# EAGLE design MIDIPak_v1 (EAGLE 7.7.0)
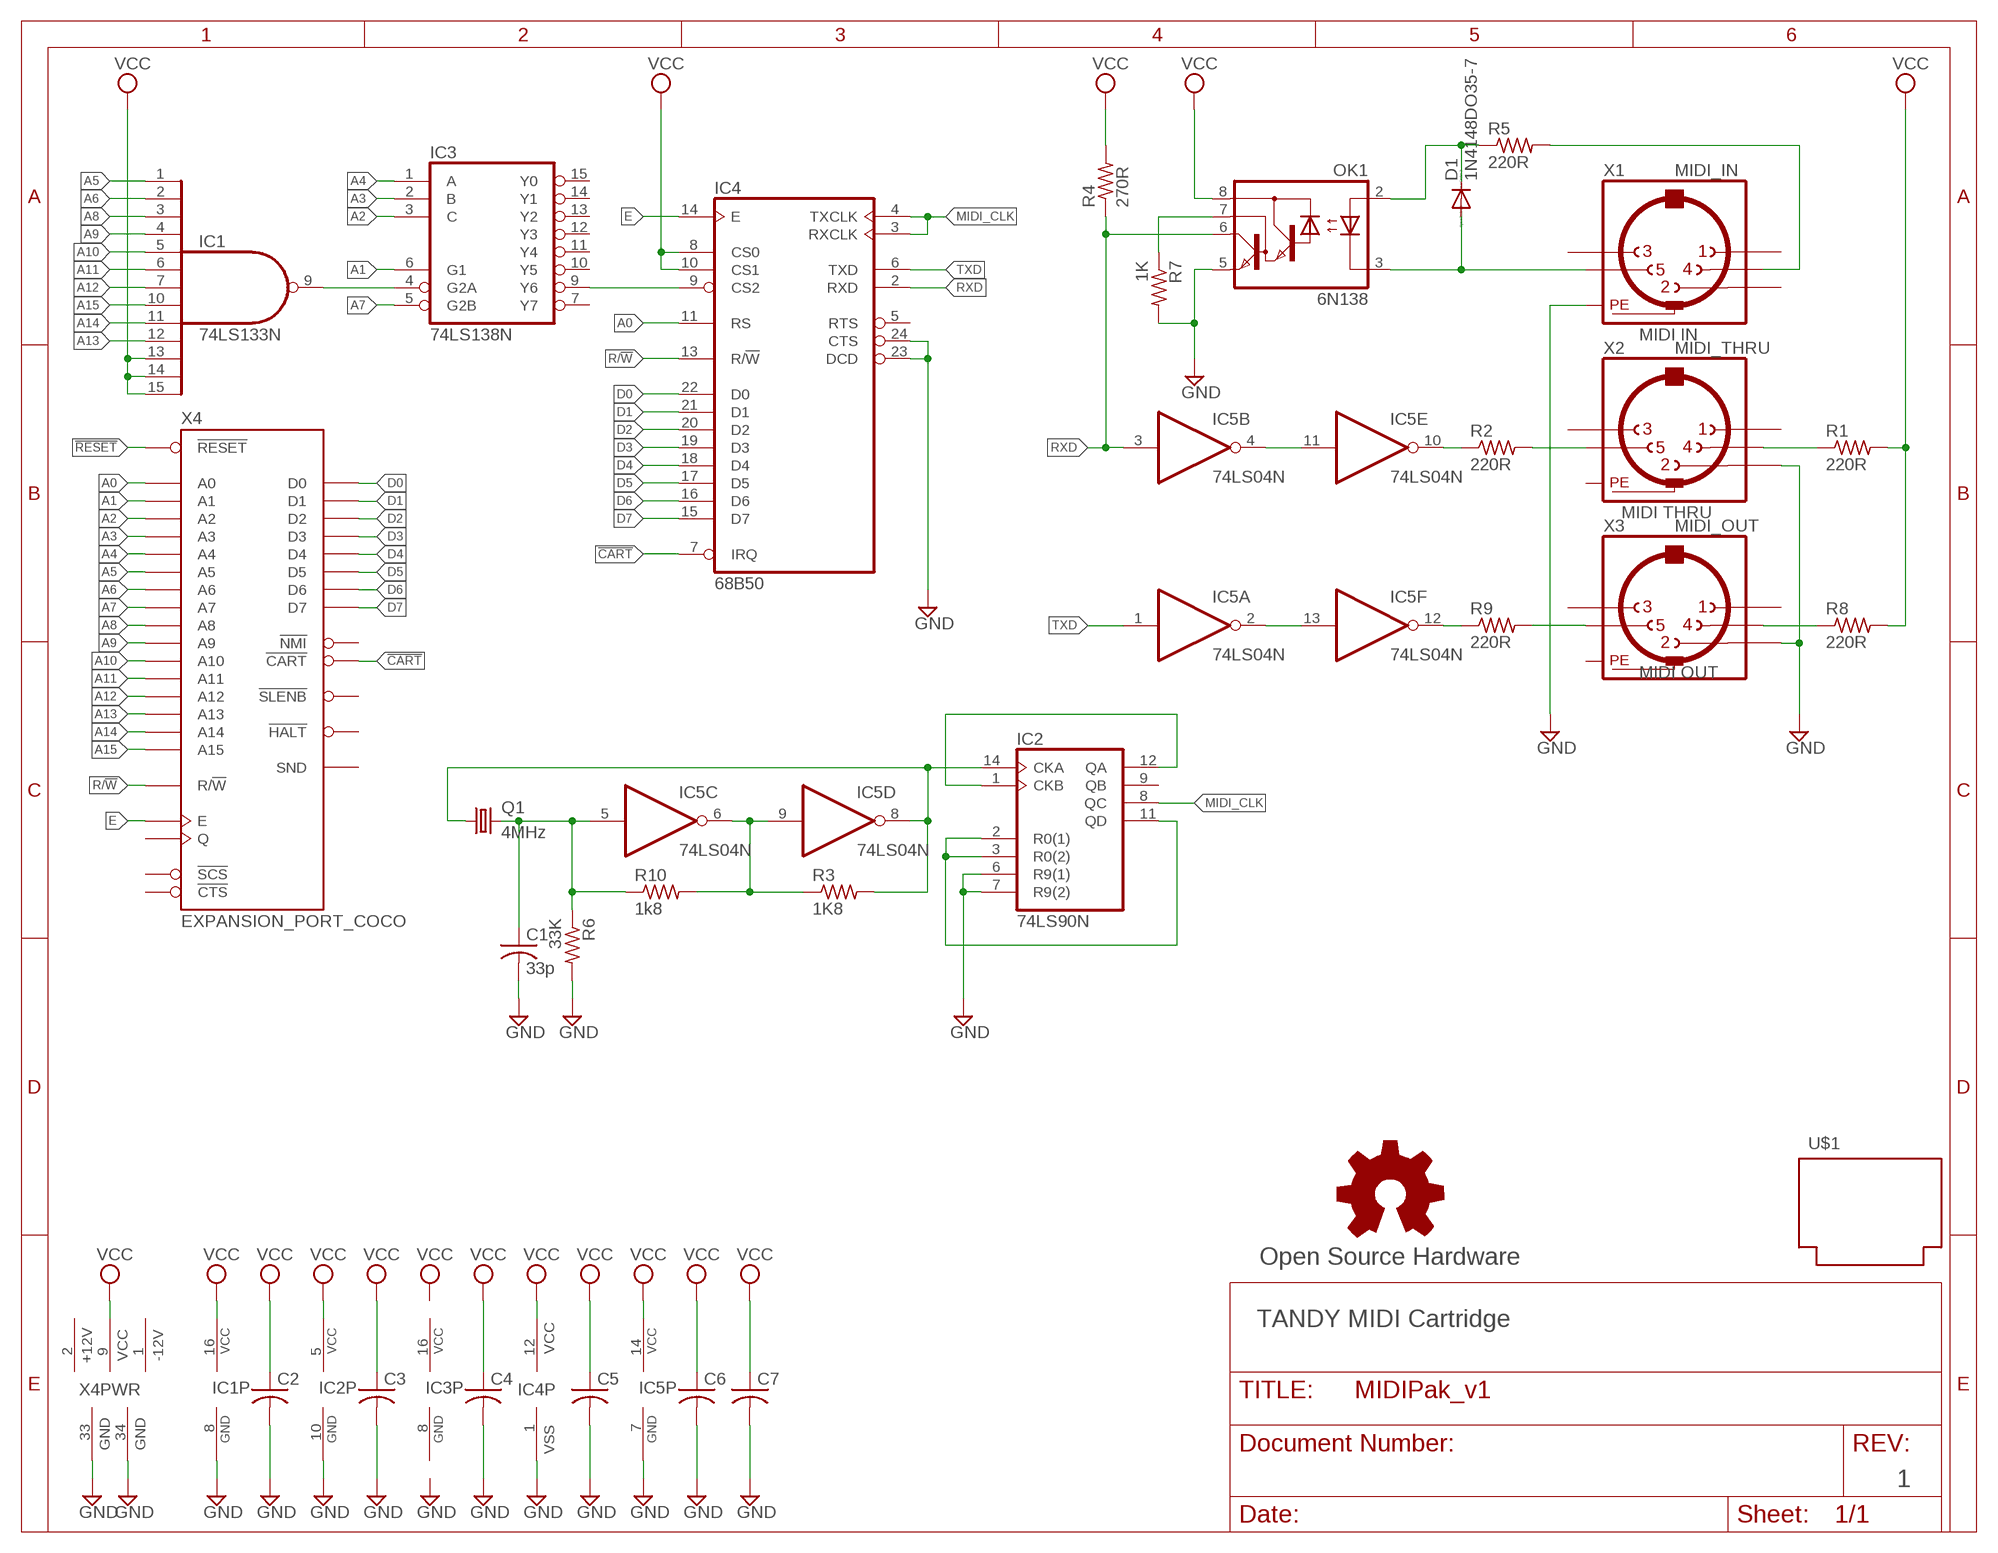
[diagram p0: schematic, sheet 1]

## Parts
C1  33p  C-US025-025X050  [C025-025X050]
C2  C-US025-025X050  [C025-025X050]
C3  C-US025-025X050  [C025-025X050]
C4  C-US025-025X050  [C025-025X050]
C5  C-US025-025X050  [C025-025X050]
C6  C-US025-025X050  [C025-025X050]
C7  C-US025-025X050  [C025-025X050]
D1  1N4148DO35-7  [DO35-7]
GOLD_ORB_SM1  Open Source Hardware  OSHWLOGOLOGO8MM  [OSHW_8MM]
IC1  74LS133N  74S133N  [DIL16-RP]
IC2  74LS90N  [DIL14-RP]
IC3  74LS138N  [DIL16-RP]
IC4  68B50  6850-RP  [DIL24-ROUNDPAD]
IC5  74LS04N  [DIL14-RP]
OK1  6N138  [DIL08]
Q1  4MHz  CRYSTALHC49U-V  [HC49U-V]
R1  220R  R-US_0204/7  [0204/7]
R2  220R  R-US_0204/7  [0204/7]
R3  1K8  R-US_0204/7  [0204/7]
R4  270R  R-US_0204/7  [0204/7]
R5  220R  R-US_0204/7  [0204/7]
R6  33K  R-US_0204/7  [0204/7]
R7  1K  R-US_0204/7  [0204/7]
R8  220R  R-US_0204/7  [0204/7]
R9  220R  R-US_0204/7  [0204/7]
R10  1k8  R-US_0204/7  [0204/7]
U$1  PROGRAM_PAK  [PROGRAM_PAK]
X1  MIDI_IN  MAB5SH  [MAB5SH]
X2  MIDI_THRU  MAB5SH  [MAB5SH]
X3  MIDI_OUT  MAB5SH  [MAB5SH]
X4  EXPANSION_PORT_COCO  [MA20-2]

## Nets
!CART: IC4.7(IRQ) X4.8(!CART)
!RESET: X4.5(!RESET)
A0: IC4.11(RS) X4.19(A0)
A1: IC3.6(G1) X4.20(A1)
A2: IC3.3(C) X4.21(A2)
A3: IC3.2(B) X4.22(A3)
A4: IC3.1(A) X4.23(A4)
A5: IC1.1(I0) X4.24(A5)
A6: IC1.2(I1) X4.25(A6)
A7: IC3.5(G2B) X4.26(A7)
A8: IC1.3(I2) X4.27(A8)
A9: IC1.4(I3) X4.28(A9)
A10: IC1.5(I4) X4.29(A10)
A11: IC1.6(I5) X4.30(A11)
A12: IC1.7(I6) X4.31(A12)
A13: IC1.12(I9) X4.37(A13)
A14: IC1.11(I8) X4.38(A14)
A15: IC1.10(I7) X4.39(A15)
D0: IC4.22(D0) X4.10(D0)
D1: IC4.21(D1) X4.11(D1)
D2: IC4.20(D2) X4.12(D2)
D3: IC4.19(D3) X4.13(D3)
D4: IC4.18(D4) X4.14(D4)
D5: IC4.17(D5) X4.15(D5)
D6: IC4.16(D6) X4.16(D6)
D7: IC4.15(D7) X4.17(D7)
E: IC4.14(E) X4.6(E)
GND: C1.2 C2.2 C3.2 C4.2 C5.2 C6.2 C7.2 IC1.8(GND) IC2.6(R9(1)) IC2.7(R9(2)) IC2.10(GND) IC4.1(VSS) IC4.23(DCD) IC4.24(CTS) IC5.7(P:GND) OK1.5(GND) R6.2 R7.2 X1.PE X1.PE@(PE) X2.2 X3.2 X4.33(GND) X4.34(GND)
MIDI_CLK: IC2.8(QC) IC4.3(RXCLK) IC4.4(TXCLK)
N$1: R9.2 X3.5
N$2: IC5.2(A:O) IC5.13(F:I)
N$3: R8.1 X3.4
N$4: IC5.12(F:O) R9.1
N$5: IC3.9(Y6) IC4.9(CS2)
N$6: D1.C OK1.2(A) R5.1
N$7: R5.2 X1.4
N$8: D1.A OK1.3(C) X1.5
N$9: OK1.7(VB) R7.1
N$10: R2.2 X2.5
N$11: IC5.10(E:O) R2.1
N$12: IC5.4(B:O) IC5.11(E:I)
N$13: R1.1 X2.4
N$14: IC1.9(O) IC3.4(G2A)
N$15: C1.1 IC5.5(C:I) Q1.2 R6.1 R10.1
N$16: IC5.6(C:O) IC5.9(D:I) R3.1 R10.2
N$17: IC2.14(CKA) IC5.8(D:O) Q1.1 R3.2
N$19: IC2.1(CKB) IC2.12(QA)
N$20: IC2.2(R0(1)) IC2.3(R0(2)) IC2.11(QD)
R/!W: IC4.13(R/!W) X4.18(R/!W)
RXD: IC4.2(RXD) IC5.3(B:I) OK1.6(VO) R4.1
TXD: IC4.6(TXD) IC5.1(A:I)
VCC: C2.1 C3.1 C4.1 C5.1 C6.1 C7.1 IC1.13(I10) IC1.14(I11) IC1.15(I12) IC1.16(VCC) IC2.5(VCC) IC4.8(CS0) IC4.10(CS1) IC4.12(VCC) IC5.14(P:VCC) OK1.8(VCC) R1.2 R4.2 R8.2 X4.9(VCC)
Unconnected: IC2.9(QB) IC3.7(Y7) IC3.10(Y5) IC3.11(Y4) IC3.12(Y3) IC3.13(Y2) IC3.14(Y1) IC3.15(Y0) IC4.5(RTS) X1.1 X1.2 X1.3 X2.1 X2.3 X3.1 X3.3 X4.3(!HALT) X4.4(!NMI) X4.7(Q) X4.32(!CTS) X4.35(SND) X4.36(!SCS) X4.40(!SLENB)

## Notes on the sheet
- MIDI IN
- MIDI THRU
- MIDI OUT
- TANDY MIDI Cartridge
- 1

## Power pins joined to a net without a drawn wire
+12V: X4.2(+12V)
-12V: X4.1(-12V)
GND: IC3.8(GND)
PE: X2.PE X2.PE@(PE) X3.PE X3.PE@(PE)
VCC: IC3.16(VCC)

## Library data of the parts
C1-C7 = rcl:C-US: CAPACITOR, American symbol
D1 = diode-jlb:1N4148: DIODE high speed (Philips)
GOLD_ORB_SM1 = oshw:OSHWLOGO: The OSHW logo for PCB layout
IC1 = 74xx-us-jlb:74*133: 13-input NAND gate
IC2 = 74xx-us-jlb:74*90: Decade, divide by twelve and binary COUNTER
IC3 = 74xx-us-jlb:74*138: 3-line to 8-line DECODER/DEMULTIPLEXER
IC4 = micro-motorola:6850: MICROCONTROLLER/MEMORY DEVICE
IC5 = 74xx-us-jlb:74*04: Hex INVERTER
OK1 = optocoupler-jlb:6N138: MOTOROLA OPTO COUPLER; MF: VISHAY/TELEFUNKEN; MPN: 6N138; OC_FARNELL: 9860150; OC_NEWARK: 35K5294
Q1 = crystal:CRYSTAL: CRYSTAL; OC_FARNELL: 1666969; OC_NEWARK: unknown
R1-R10 = resistor:R-US_: RESISTOR, American symbol
U$1 = coco:PROGRAM_PAK
X1-X3 = con-hirschmann:MAB5SH: Female CONNECTOR 5 pins 90 deg. with shield, horizontal (DIN 41524); OC_FARNELL: 809883; OC_NEWARK: unknown
X4 = coco:EXPANSION_PORT_COCO

## Board
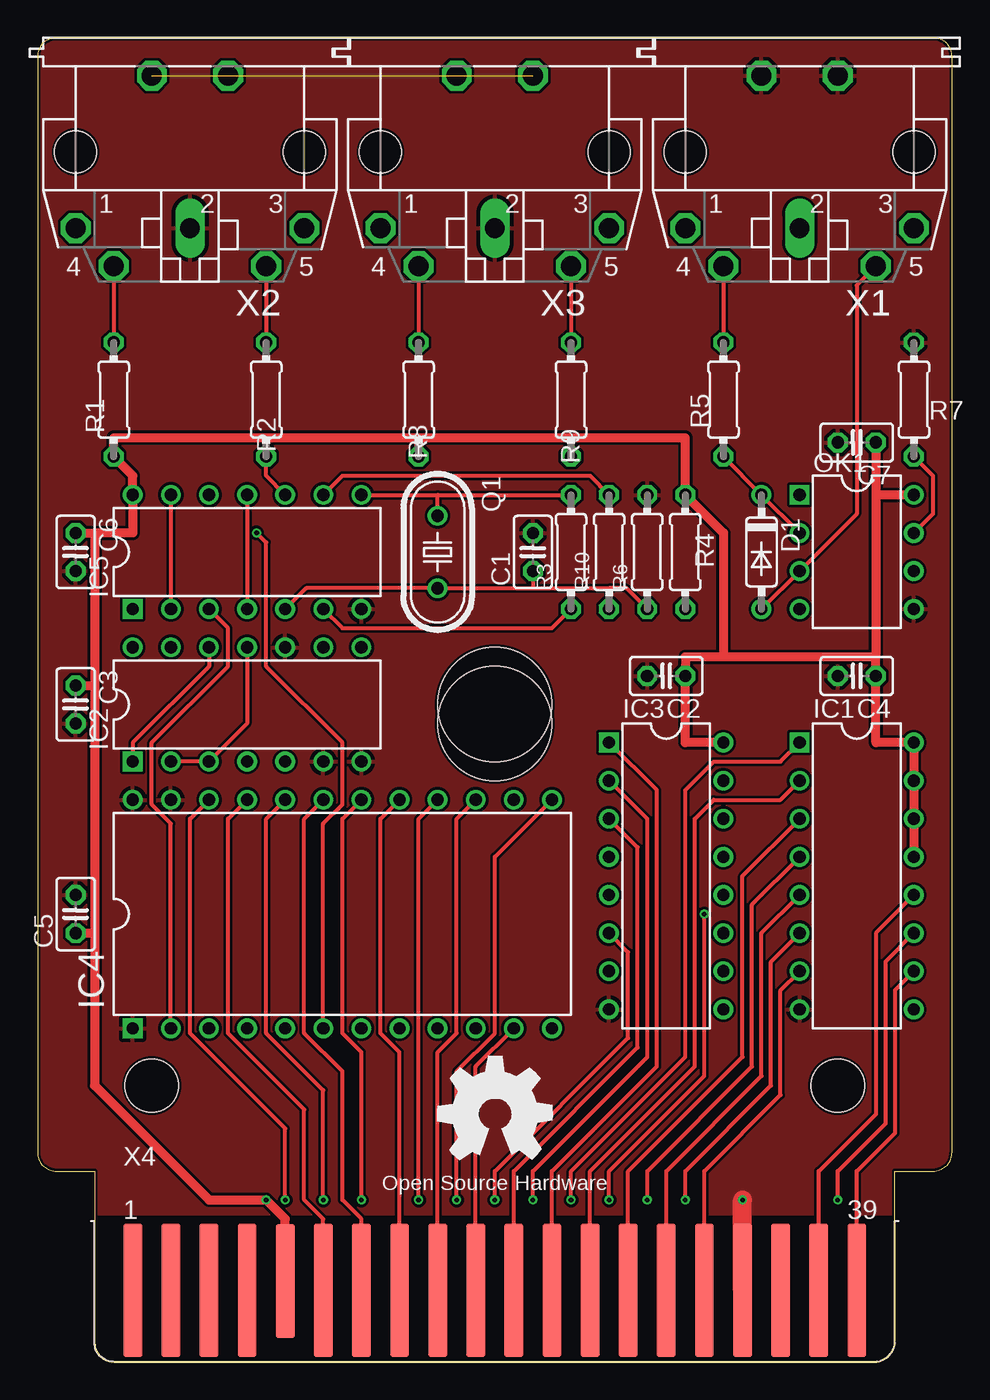
[diagram p1: board, top side]
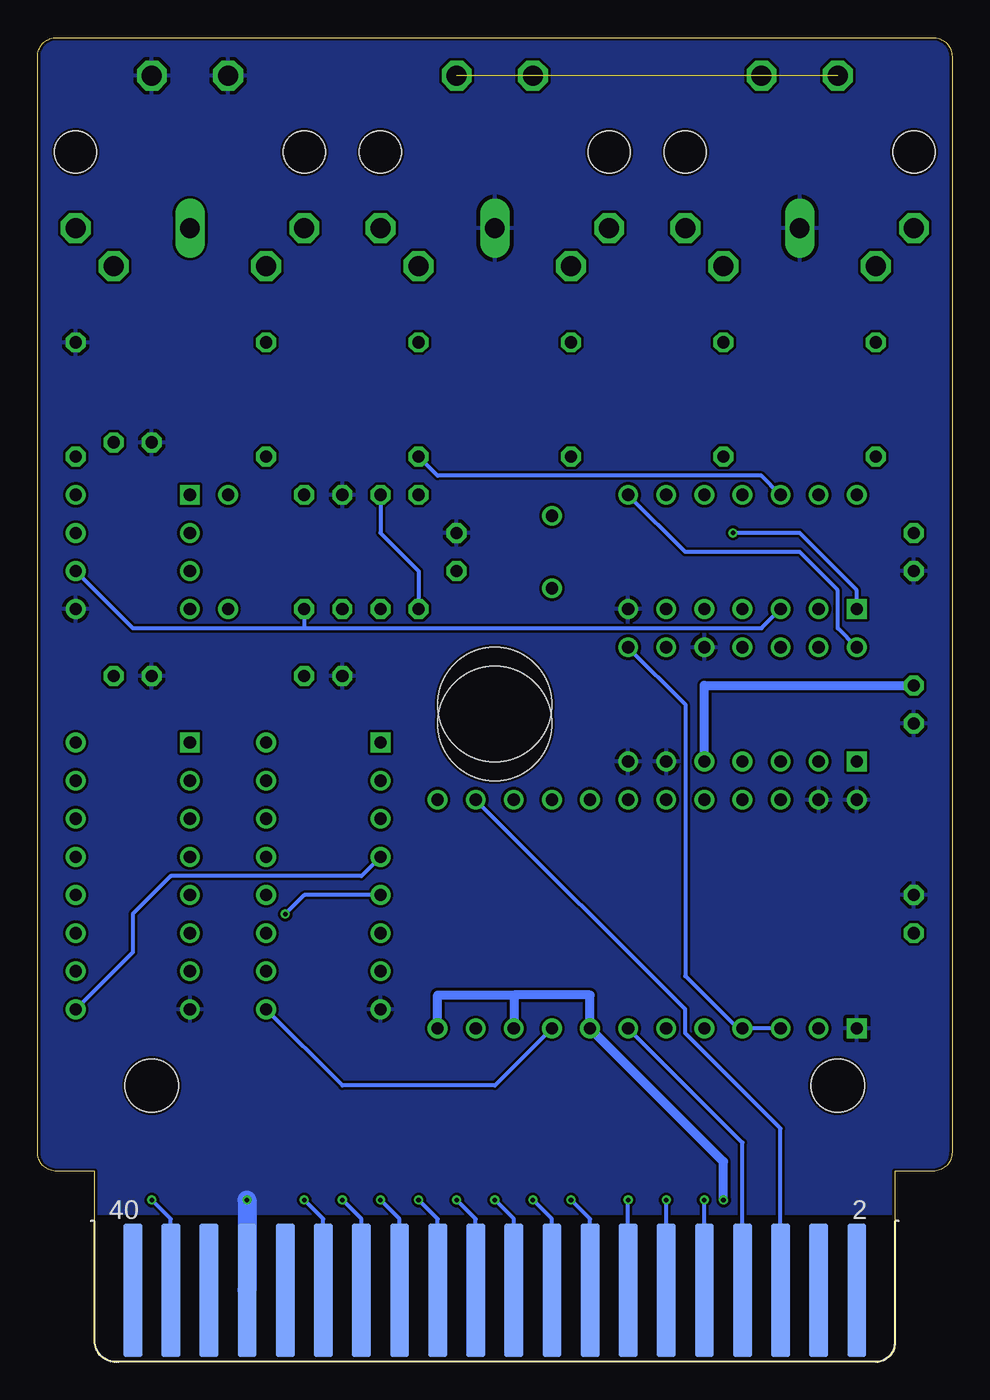
[diagram p2: board, bottom side, seen from below]

Size 60.96 x 88.27 mm. Coordinates in mm from the lower left corner, seen from the top.
Outline: 3.81,12.71 3.81,1.28 arc90 5.08,0.01 55.56,0.01 arc90 57.15,1.28 57.15,12.71 59.69,12.71 arc90 60.96,13.98 60.96,87 arc90 59.69,88.27 1.27,88.27 arc90 0,87 0,13.98 arc90 1.27,12.71 3.81,12.71
Copper layers (1*16): Top 0.035mm / dielectric 1.5mm / Bottom 0.035mm
Design rules "hackvana *": minimum track width 6mil, minimum drill 0.3mm, track to track 6mil, track to pad 6mil, pad to pad 6mil, via to via 6mil, smd to smd 0mil, copper to edge 6mil, drill to drill 6mil, minimum pad ring 10mil, minimum via ring 6mil, stop-mask expansion 2mil, vias tented up to drill 100mil, thermal gap 10mil

### Footprints (pad centres in the part's own frame; a part is rotated, then mirrored left to right if it is on the bottom)
C025-025X050 = drill 0.813 octagon: 1 -1.27,0; 2 1.27,0
DO35-7 = drill 0.813: A 3.81,0; C -3.81,0
DIL16-RP = drill 0.813 square: 1 -8.89,-3.81 | drill 0.813: 2 -6.35,-3.81; 3 -3.81,-3.81; 4 -1.27,-3.81; 5 1.27,-3.81; 6 3.81,-3.81; 7 6.35,-3.81; 8 8.89,-3.81; 9 8.89,3.81; 10 6.35,3.81; 11 3.81,3.81; 12 1.27,3.81; 13 -1.27,3.81; 14 -3.81,3.81; 15 -6.35,3.81; 16 -8.89,3.81
DIL14-RP = drill 0.813 square: 1 -7.62,-3.81 | drill 0.813: 2 -5.08,-3.81; 3 -2.54,-3.81; 4 0,-3.81; 5 2.54,-3.81; 6 5.08,-3.81; 7 7.62,-3.81; 8 7.62,3.81; 9 5.08,3.81; 10 2.54,3.81; 11 0,3.81; 12 -2.54,3.81; 13 -5.08,3.81; 14 -7.62,3.81
DIL24-ROUNDPAD = drill 0.813 square: 1 -13.97,-7.62 | drill 0.813: 2 -11.43,-7.62; 3 -8.89,-7.62; 4 -6.35,-7.62; 5 -3.81,-7.62; 6 -1.27,-7.62; 7 1.27,-7.62; 8 3.81,-7.62; 9 6.35,-7.62; 10 8.89,-7.62; 11 11.43,-7.62; 12 13.97,-7.62; 13 13.97,7.62; 14 11.43,7.62; 15 8.89,7.62; 16 6.35,7.62; 17 3.81,7.62; 18 1.27,7.62; 19 -1.27,7.62; 20 -3.81,7.62; 21 -6.35,7.62; 22 -8.89,7.62; 23 -11.43,7.62; 24 -13.97,7.62
DIL08 = drill 0.813 square: 1 -3.81,-3.81 | drill 0.813: 2 -1.27,-3.81; 3 1.27,-3.81; 4 3.81,-3.81; 5 3.81,3.81; 6 1.27,3.81; 7 -1.27,3.81; 8 -3.81,3.81
HC49U-V = drill 0.813: 1 -2.413,0; 2 2.413,0
0204/7 = drill 0.813 octagon: 1 -3.81,0; 2 3.81,0
PROGRAM_PAK = hole 7.62: 0,1.27; 0,0 | hole 3.556: -22.86,-24.13; 22.86,-24.13
MAB5SH = drill 1.321 octagon: 1 7.62,5.08; 3 -7.62,5.08; 4 5.08,7.62; 5 -5.08,7.62; PE -2.54,-5.08; PE@ 2.54,-5.08 | drill 1.321 long: 2 0,5.08 | hole 2.794: 7.62,0; -7.62,0
MA20-2 = smd 1.27 x 8.89: 1 -24.13,-0.305; 3 -21.59,-0.305; 5 -19.05,-0.305; 7 -16.51,-0.305; 11 -11.43,-0.305; 13 -8.89,-0.305; 15 -6.35,-0.305; 17 -3.81,-0.305; 19 -1.27,-0.305; 21 1.27,-0.305; 23 3.81,-0.305; 25 6.35,-0.305; 27 8.89,-0.305; 29 11.43,-0.305; 31 13.97,-0.305; 33 16.51,-0.305; 35 19.05,-0.305; 37 21.59,-0.305; 39 24.13,-0.305 | smd 1.27 x 8.89 bottom: 2 -24.13,-0.305; 4 -21.59,-0.305; 6 -19.05,-0.305; 8 -16.51,-0.305; 10 -13.97,-0.305; 12 -11.43,-0.305; 14 -8.89,-0.305; 16 -6.35,-0.305; 18 -3.81,-0.305; 20 -1.27,-0.305; 22 1.27,-0.305; 24 3.81,-0.305; 26 6.35,-0.305; 28 8.89,-0.305; 30 11.43,-0.305; 32 13.97,-0.305; 34 16.51,-0.305; 36 19.05,-0.305; 38 21.59,-0.305; 40 24.13,-0.305 | smd 1.27 x 7.62: 9 -13.97,0.305

### Placement (x,y rotation side)
C1  33.02,53.98 90 top
C2  41.91,45.73 180 top
C3  2.54,43.82 270 top
C4  54.61,45.73 180 top
C5  2.54,29.85 90 top
C6  2.54,53.98 270 top
C7  54.61,61.29 180 top
D1  48.26,53.98 270 top
GOLD_ORB_SM1  30.48,16.52 0 top
IC1  54.61,32.39 270 top
IC2  13.97,43.82 0 top
IC3  41.91,32.39 270 top
IC4  20.32,29.85 0 top
IC5  13.97,53.98 0 top
OK1  54.61,53.98 270 top
Q1  26.67,53.98 270 top
R1  5.08,64.14 270 top
R2  15.24,64.14 90 top
R3  35.56,53.98 90 top
R4  43.18,53.98 90 top
R5  45.72,64.14 90 top
R6  40.64,53.98 90 top
R7  58.42,64.14 90 top
R8  25.4,64.14 270 top
R9  35.56,64.14 90 top
R10  38.1,53.98 90 top
U$1  30.48,42.55 0 top
X1  50.8,80.65 180 top
X2  10.16,80.65 180 top
X3  30.48,80.65 180 top
X4  30.48,5.09 0 top

### Tracks (layer width: path | path; a pad name or v marks a point on that pad's centre or on a via)
!CART
  Bottom 0.254: X4.8 13.97,14.61 IC4.7
A0
  Top 0.254: X4.19 29.21,19.69 IC4.11
A1  (via drill 0.3)
  Top 0.254: v30.48,10.8 30.48,12.71 39.37,21.6 39.37,27.31 IC3.6
  Bottom 0.254: X4.20 29.21,9.53 v30.48,10.8
A2
  Top 0.254: X4.21 31.75,12.71 40.01,20.96 40.01,34.3 IC3.3
A3  (via drill 0.3)
  Top 0.254: v33.02,10.8 33.02,12.71 40.64,20.33 40.64,36.2 IC3.2
  Bottom 0.254: X4.22 31.75,9.53 v33.02,10.8
A4
  Top 0.254: X4.23 34.29,12.71 41.27,19.69 41.27,38.11 IC3.1
A5  (via drill 0.3)
  Top 0.254: v35.56,10.8 35.56,12.71 43.18,20.33 43.18,38.11 45.09,40.01 49.53,40.01 IC1.1
  Bottom 0.254: X4.24 34.29,9.53 v35.56,10.8
A6
  Top 0.254: X4.25 36.83,12.71 43.81,19.69 43.81,36.2 45.09,37.47 49.53,37.47 IC1.2
A7  (via drill 0.3)
  Top 0.254: v38.1,10.8 38.1,12.71 44.45,19.06 v44.45,29.85
  Bottom 0.254: X4.26 36.83,9.53 v38.1,10.8 | v44.45,29.85 43.18,31.12 IC3.5
A8
  Top 0.254: X4.27 39.37,12.71 46.99,20.33 46.99,32.39 IC1.3
A9  (via drill 0.3)
  Top 0.254: v40.64,10.8 40.64,12.71 47.62,19.69 47.62,30.49 IC1.4
  Bottom 0.254: X4.28 39.37,9.53 v40.64,10.8
A10
  Top 0.254: X4.29 41.91,12.71 48.26,19.06 48.26,28.58 IC1.5
A11  (via drill 0.3)
  Top 0.254: v43.18,10.8 43.18,12.71 48.89,18.42 48.89,26.68 IC1.6
  Bottom 0.254: X4.30 41.91,9.53 v43.18,10.8
A12
  Top 0.254: X4.31 44.45,12.71 49.53,17.79 49.53,24.77 IC1.7
A13
  Top 0.254: X4.37 52.07,12.71 55.88,16.52 55.88,28.58 IC1.12
A14  (via drill 0.3)
  Top 0.254: v53.34,10.8 53.34,12.71 56.52,15.88 56.52,26.68 IC1.11
  Bottom 0.254: X4.38 52.07,9.53 v53.34,10.8
A15
  Top 0.254: X4.39 54.61,12.71 57.15,15.25 57.15,24.77 IC1.10
D0  (via drill 0.3)
  Top 0.254: v16.51,10.8 16.51,15.57 10.16,21.92 10.16,36.2 IC4.22
  Bottom 0.254: X4.10 v16.51,10.8
D1
  Top 0.254: X4.11 19.05,9.53 17.78,10.8 17.78,16.84 12.7,21.92 12.7,36.2 IC4.21
D2  (via drill 0.3)
  Top 0.254: v19.05,10.8 19.05,18.11 15.24,21.92 15.24,36.2 IC4.20
  Bottom 0.254: X4.12 v19.05,10.8
D3
  Top 0.254: X4.13 21.59,9.53 20.32,10.8 20.32,19.38 17.78,21.92 17.78,36.2 IC4.19
D4  (via drill 0.3)
  Top 0.254: v21.59,10.8 21.59,20.65 20.32,21.92 20.32,36.2 IC4.18
  Bottom 0.254: X4.14 v21.59,10.8
D5
  Top 0.254: X4.15 24.13,20.65 22.86,21.92 22.86,36.2 IC4.17
D6  (via drill 0.3)
  Top 0.254: v25.4,10.8 25.4,36.2 IC4.16
  Bottom 0.254: X4.16 24.13,9.53 v25.4,10.8
D7
  Top 0.254: X4.17 26.67,20.65 27.94,21.92 27.94,36.2 IC4.15
E
  Bottom 0.254: X4.6 11.43,15.57 17.78,21.92 17.78,23.5 IC4.14
GND  (via drill 0.3)
  Top 1.27: X4.34 v46.99,10.8
  Bottom 1.27: v46.99,10.8 X4.34
  pour Top (isolate 0.178): 60.96,13.98 60.96,87 arc90 59.69,88.27 1.27,88.27 arc90 0,87 0,13.98 arc90 1.27,12.71 3.81,12.71 3.81,9.85 57.15,9.85 57.15,12.71 59.69,12.71 arc90
  pour Bottom (isolate 0.178): 0,87 0,13.98 arc90 1.27,12.71 3.81,12.71 3.81,9.85 57.15,9.85 57.15,12.71 59.69,12.71 arc90 60.96,13.98 60.96,87 arc90 59.69,88.27 1.27,88.27 arc90
MIDI_CLK
  Bottom 0.254: IC4.3 IC4.4 14.29,22.23 17.78,25.73 17.78,43.82 IC2.8
N$1
  Top 0.254: X3.5 R9.2
N$2
  Top 0.254: IC5.13 IC5.2
N$3
  Top 0.254: X3.4 R8.1
N$4
  Bottom 0.254: IC5.12 12.7,59.06 34.29,59.06 R9.1
N$5
  Bottom 0.254: IC4.9 30.48,18.42 40.64,18.42 IC3.9
N$6
  Top 0.254: OK1.2 D1.C R5.1
N$7
  Top 0.254: X1.4 R5.2
N$8
  Top 0.254: D1.A OK1.3 54.61,56.52 54.61,71.76 X1.5
N$9
  Top 0.254: R7.1 59.69,59.06 59.69,56.52 OK1.7
N$10
  Top 0.254: X2.5 R2.2
N$11
  Top 0.254: IC5.10 15.24,59.06 R2.1
N$12
  Top 0.254: IC5.11 IC5.4
N$13
  Top 0.254: X2.4 R1.1
N$14
  Bottom 0.254: IC3.4 39.37,32.39 52.07,32.39 54.61,29.85 54.61,27.31 IC1.9
N$15
  Top 0.254: IC5.5 17.91,51.57 Q1.2 33.02,51.57 | 33.02,51.57 38.1,51.57 | R10.1 38.1,51.57 | C1.1 33.02,51.57 | R6.1 39.24,51.57 38.1,51.57
N$16
  Top 0.254: IC5.6 20.32,48.9 34.29,48.9 R3.1 | IC5.9 20.32,59.06 36.83,59.06 R10.2
  Bottom 0.254: R10.2 38.1,55.25 35.56,52.71 R3.1
N$17
  Top 0.254: IC5.8 26.67,57.79 | 26.67,57.79 R3.2 | Q1.1 26.67,57.79
  Bottom 0.254: IC5.8 17.78,53.98 10.16,53.98 7.62,51.44 7.62,48.9 IC2.14
N$19
  Top 0.254: IC2.12 11.43,46.36 6.35,41.28 IC2.1
N$20
  Top 0.254: IC2.11 13.97,42.55 IC2.3 IC2.2
PE  (3 unrouted)
R/!W  (via drill 0.3)
  Top 0.254: v27.94,10.8 27.94,19.38 30.48,21.92 30.48,33.66 IC4.13
  Bottom 0.254: X4.18 26.67,9.53 v27.94,10.8
RXD
  Top 0.254: IC4.2 8.89,35.89 7.62,37.16 7.62,41.28 12.7,46.36 12.7,48.9 IC5.3
  Bottom 0.254: OK1.6 54.61,48.9 43.18,48.9 | 43.18,48.9 12.7,48.9 IC5.3 | R4.1 43.18,48.9
TXD  (via drill 0.3)
  Top 0.254: IC4.6 19.05,35.89 20.32,37.16 20.32,41.28 15.24,46.36 15.24,54.62 v14.61,55.25
  Bottom 0.254: IC5.1 6.35,51.44 10.16,55.25 v14.61,55.25
VCC  (via drill 0.3)
  Top 0.61: X4.9 16.51,9.53 v15.24,10.8 11.43,10.8 3.81,18.42 3.81,28.58 | C3.1 3.81,45.09 | 3.81,45.09 3.81,28.58 | C6.1 3.81,55.25 | 3.81,55.25 3.81,45.09 | 3.81,55.25 6.35,55.25 IC5.14 6.35,59.06 R1.2 5.08,61.6 25.4,61.6 | 25.4,61.6 R8.2 | IC3.16 43.18,41.28 C2.1 43.18,47 45.72,47 | IC1.13 IC1.14 IC1.15 IC1.16 55.88,41.28 C4.1 55.88,47 | 55.88,47 45.72,47 | 25.4,61.6 43.18,61.6 R4.2 45.72,55.25 45.72,47 | C5.1 3.81,28.58 | OK1.8 55.88,57.79 | 55.88,57.79 55.88,47 | C7.1 55.88,57.79
  Bottom 0.61: v15.24,10.8 15.24,13.34 IC4.8 24.13,24.46 29.21,24.46 | IC2.5 16.51,45.09 C3.1 | 29.21,24.46 IC4.10 | IC4.12 34.29,24.46 29.21,24.46